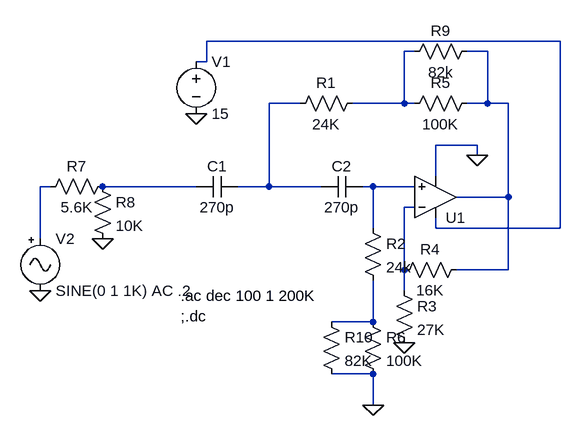
[diagram p0: schematic hpf.asc]
hpf.asc, the LTspice schematic file:
Version 4.1
SHEET 1 880 680
WIRE 496 -128 -48 -128
WIRE 272 -112 256 -112
WIRE 384 -112 352 -112
WIRE -48 -96 -48 -128
WIRE -48 -96 -64 -96
WIRE 96 -32 48 -32
WIRE 256 -32 256 -112
WIRE 256 -32 176 -32
WIRE 272 -32 256 -32
WIRE 384 -32 384 -112
WIRE 384 -32 352 -32
WIRE 416 -32 384 -32
WIRE 368 32 304 32
WIRE 368 48 368 32
WIRE 304 80 304 32
WIRE -288 96 -304 96
WIRE -64 96 -208 96
WIRE 48 96 48 -32
WIRE 48 96 0 96
WIRE 128 96 48 96
WIRE 208 96 192 96
WIRE 272 96 208 96
WIRE 416 112 416 -32
WIRE 416 112 336 112
WIRE 272 128 256 128
WIRE 208 160 208 96
WIRE 304 160 304 144
WIRE 496 160 496 -128
WIRE 496 160 304 160
WIRE -304 176 -304 96
WIRE 256 224 256 128
WIRE 416 224 416 112
WIRE 416 224 336 224
WIRE 256 256 256 224
WIRE 208 304 208 240
WIRE 208 304 144 304
WIRE 208 384 144 384
WIRE 208 432 208 384
FLAG 256 336 0
FLAG -64 -16 0
FLAG 368 48 0
FLAG -304 256 0
FLAG -208 176 0
FLAG 208 432 0
SYMBOL cap 192 80 R90
WINDOW 0 0 32 VBottom 2
WINDOW 3 32 32 VTop 2
SYMATTR InstName C2
SYMATTR Value 270p
SYMBOL res 192 -48 R90
WINDOW 0 0 56 VBottom 2
WINDOW 3 32 56 VTop 2
SYMATTR InstName R1
SYMATTR Value 24K
SYMBOL OpAmps\\UniversalOpAmp2 304 112 M180
SYMATTR InstName U1
SYMBOL res 192 144 R0
SYMATTR InstName R2
SYMATTR Value 24k
SYMBOL res 240 240 R0
SYMATTR InstName R3
SYMATTR Value 27K
SYMBOL res 352 208 R90
WINDOW 0 0 56 VBottom 2
WINDOW 3 32 56 VTop 2
SYMATTR InstName R4
SYMATTR Value 16K
SYMBOL res 368 -48 R90
WINDOW 0 0 56 VBottom 2
WINDOW 3 32 56 VTop 2
SYMATTR InstName R5
SYMATTR Value 100K
SYMBOL res 192 288 R0
SYMATTR InstName R6
SYMATTR Value 100K
SYMBOL voltage -64 -112 R0
SYMATTR InstName V1
SYMATTR Value 15
SYMBOL Misc\\signal -304 160 R0
SYMATTR InstName V2
SYMATTR Value SINE(0 1 1K) AC .2
SYMBOL res -192 80 R90
WINDOW 0 0 56 VBottom 2
WINDOW 3 32 56 VTop 2
SYMATTR InstName R7
SYMATTR Value 5.6K
SYMBOL res -224 80 R0
SYMATTR InstName R8
SYMATTR Value 10K
SYMBOL cap 0 80 R90
WINDOW 0 0 32 VBottom 2
WINDOW 3 32 32 VTop 2
SYMATTR InstName C1
SYMATTR Value 270p
SYMBOL res 368 -128 R90
WINDOW 0 0 56 VBottom 2
WINDOW 3 32 56 VTop 2
SYMATTR InstName R9
SYMATTR Value 82k
SYMBOL res 128 288 R0
SYMATTR InstName R10
SYMATTR Value 82K
TEXT -88 264 Left 2 !.ac dec 100 1 200K\n;.dc

The netlist it stands for:
* hpf.asc
C2 N007 N004 270p
R1 N002 N004 24K
X§U1 N007 N008 N001 0 N003 level2 Avol=1Meg GBW=10Meg Slew=10Meg Ilimit=25m Rail=0 Vos=0 En=0 Enk=0 In=0 Ink=0 Rin=500Meg  ; pins In+ In- V+ V- OUT
R2 N007 N009 24k
R3 N008 0 27K
R4 N003 N008 16K
R5 N003 N002 100K
R6 N009 0 100K
V1 N001 0 15
V2 N005 0 SINE(0 1 1K) AC .2
R7 N006 N005 5.6K
R8 N006 0 10K
C1 N004 N006 270p
R9 N003 N002 82k
R10 N009 0 82K
.ac dec 100 1 200K
;.dc
.lib UniversalOpAmp2.lib
.backanno
.end